# Altium schematic sheet CompositeConnection.SchDoc
size A4; SheetNumber: 5; SheetTotal: 6
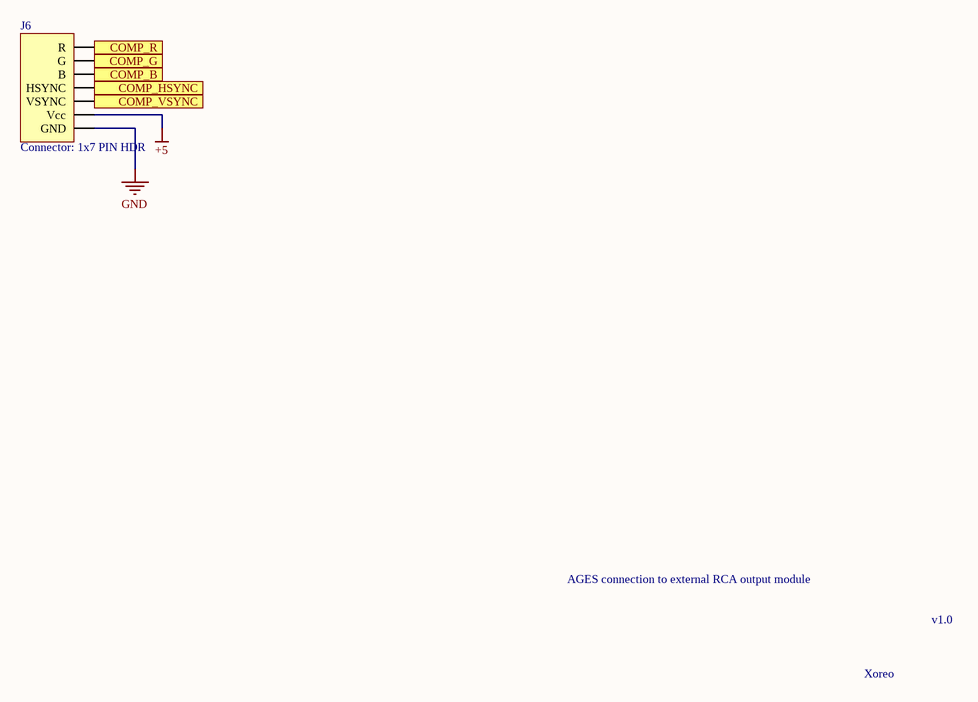
[diagram p0: CompositeConnection.SchDoc]

## Parts
J6  Connector: 1x7 PIN HDR  [7 HDR]

## Ports
COMP_B, COMP_G, COMP_HSYNC, COMP_R, COMP_VSYNC

## Nets
+5: J6.6(Vcc)
GND: J6.7(GND)
COMP_B: J6.3(B) ; port COMP_B
COMP_G: J6.2(G) ; port COMP_G
COMP_HSYNC: J6.4(HSYNC) ; port COMP_HSYNC
COMP_R: J6.1(R) ; port COMP_R
COMP_VSYNC: J6.5(VSYNC) ; port COMP_VSYNC

## Notes on the sheet
- AGES connection to external RCA output module
- v1.0
- Xoreo

## Library data of the parts
J6 = Connector: 1x7 PIN HDR: 7 pin header